# EAGLE schematic SFT_MotorBridge (EAGLE 7.2.0)
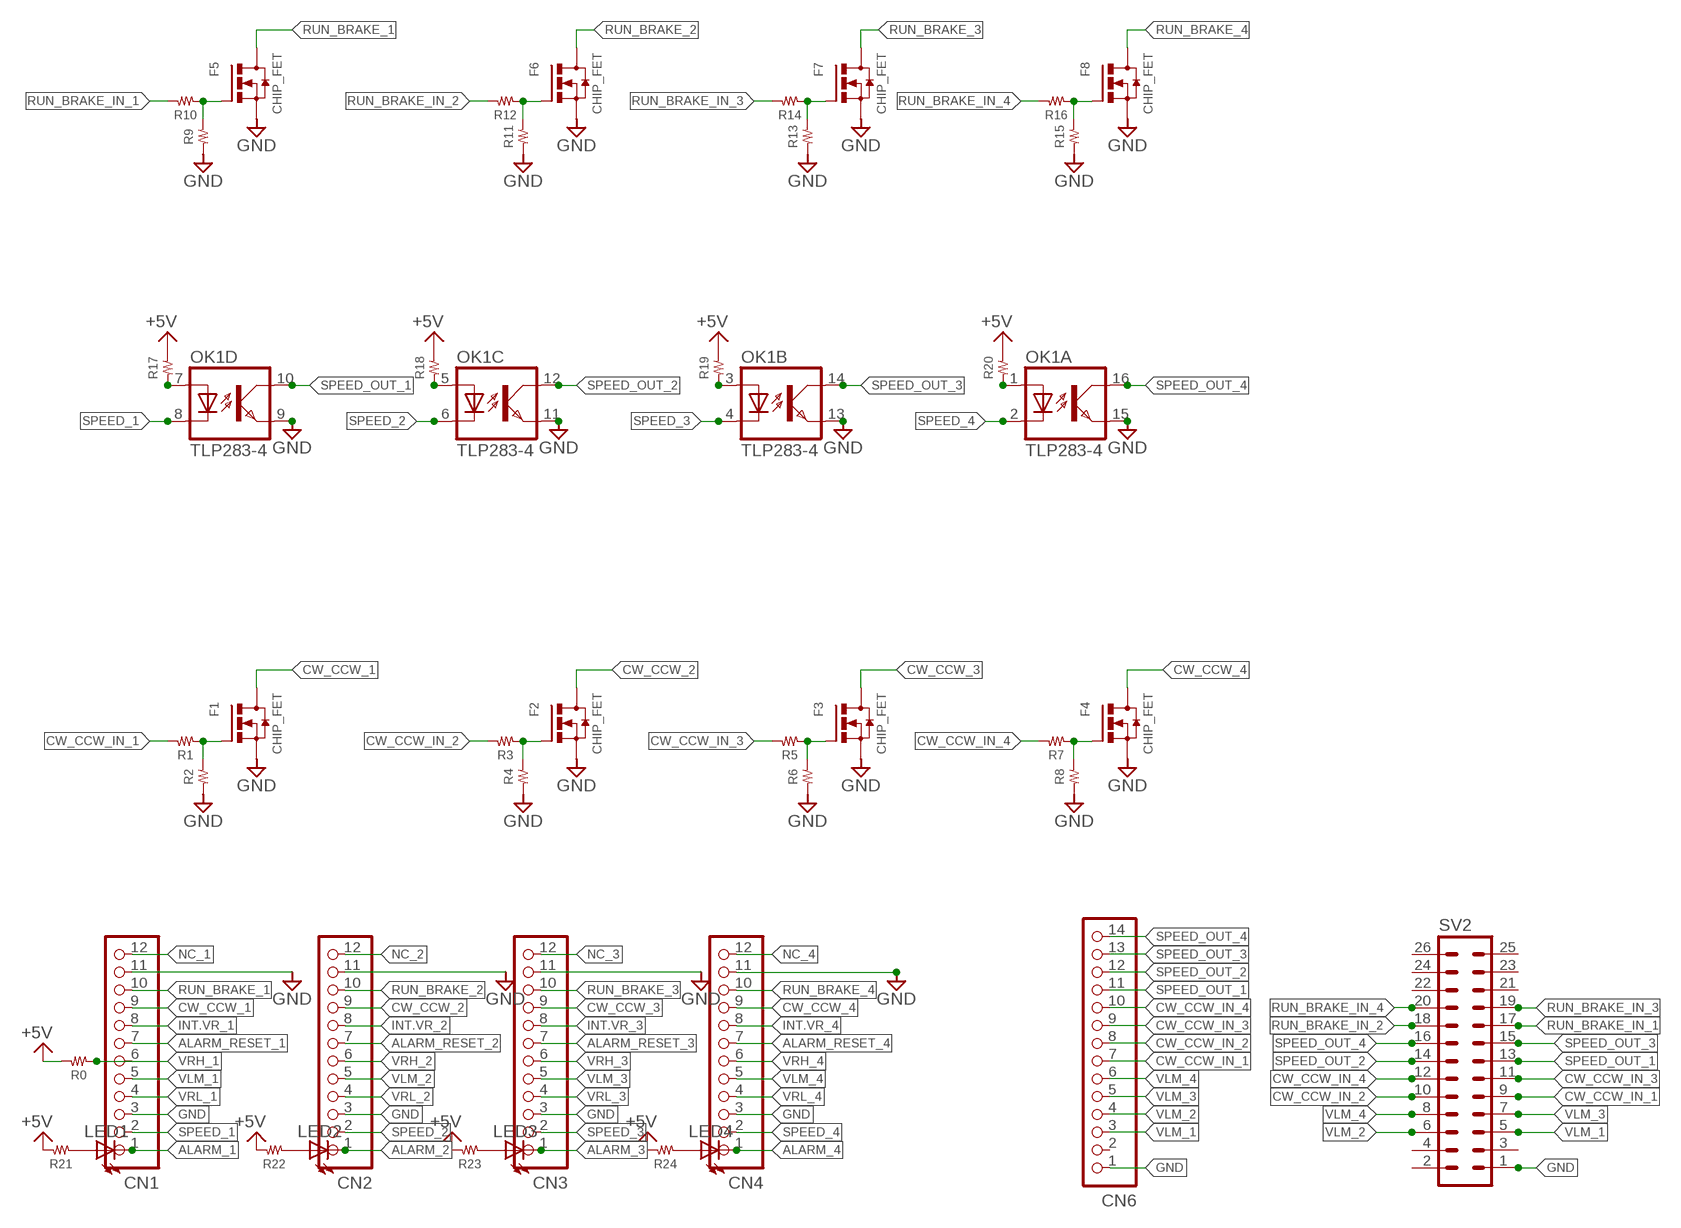
[diagram p0: schematic, sheet 1]

## Parts
CN1  B12B-XASK-1  [B12B-XASK-1]
CN2  B12B-XASK-1  [B12B-XASK-1]
CN3  B12B-XASK-1  [B12B-XASK-1]
CN4  B12B-XASK-1  [B12B-XASK-1]
CN6  B14B-XASK-1  [B14B-XASK-1]
F1  CHIP_FET  [SOT23]
F2  CHIP_FET  [SOT23]
F3  CHIP_FET  [SOT23]
F4  CHIP_FET  [SOT23]
F5  CHIP_FET  [SOT23]
F6  CHIP_FET  [SOT23]
F7  CHIP_FET  [SOT23]
F8  CHIP_FET  [SOT23]
LED1  LED5MM  [LED5MM]
LED2  LED5MM  [LED5MM]
LED3  LED5MM  [LED5MM]
LED4  LED5MM  [LED5MM]
OK1  TLP283-4  [MINI-FLAT-16]
R0  RESISTOR__SMD  [1608]
R1  RESISTOR__SMD  [1608]
R2  RESISTOR__SMD  [1608]
R3  RESISTOR__SMD  [1608]
R4  RESISTOR__SMD  [1608]
R5  RESISTOR__SMD  [1608]
R6  RESISTOR__SMD  [1608]
R7  RESISTOR__SMD  [1608]
R8  RESISTOR__SMD  [1608]
R9  RESISTOR__SMD  [1608]
R10  RESISTOR__SMD  [1608]
R11  RESISTOR__SMD  [1608]
R12  RESISTOR__SMD  [1608]
R13  RESISTOR__SMD  [1608]
R14  RESISTOR__SMD  [1608]
R15  RESISTOR__SMD  [1608]
R16  RESISTOR__SMD  [1608]
R17  RESISTOR__SMD  [1608]
R18  RESISTOR__SMD  [1608]
R19  RESISTOR__SMD  [1608]
R20  RESISTOR__SMD  [1608]
R21  RESISTOR__SMD  [1608]
R22  RESISTOR__SMD  [1608]
R23  RESISTOR__SMD  [1608]
R24  RESISTOR__SMD  [1608]
SV2  ML26  [ML26]

## Nets
+5V: R0.2 R17.2 R18.2 R19.2 R20.2 R21.2 R22.2 R23.2 R24.2
ALARM_1: CN1.1 LED1.K(C)
ALARM_2: CN2.1 LED2.K(C)
ALARM_3: CN3.1 LED3.K(C)
ALARM_4: CN4.1 LED4.K(C)
ALARM_RESET_1: CN1.7
ALARM_RESET_2: CN2.7
ALARM_RESET_3: CN3.7
ALARM_RESET_4: CN4.7
CW_CCW_1: CN1.9 F1.3(D)
CW_CCW_2: CN2.9 F2.3(D)
CW_CCW_3: CN3.9 F3.3(D)
CW_CCW_4: CN4.9 F4.3(D)
CW_CCW_IN_1: CN6.7 R1.2 SV2.9
CW_CCW_IN_2: CN6.8 R3.2 SV2.10
CW_CCW_IN_3: CN6.9 R5.2 SV2.11
CW_CCW_IN_4: CN6.10 R7.2 SV2.12
GND: CN1.3 CN1.11 CN2.3 CN2.11 CN3.3 CN3.11 CN4.3 CN4.11 F1.2(S) F2.2(S) F3.2(S) F4.2(S) F5.2(S) F6.2(S) F7.2(S) F8.2(S) OK1.9(D:EMIT) OK1.11(C:EMIT) OK1.13(B:EMIT) OK1.15(A:EMIT) R2.1 R4.1 R6.1 R8.1 R9.1 R11.1 R13.1 R15.1 SV2.1
INT.VR_1: CN1.8
INT.VR_2: CN2.8
INT.VR_3: CN3.8
INT.VR_4: CN4.8
N$1: F1.1(G) R1.1 R2.2
N$2: F2.1(G) R3.1 R4.2
N$3: F3.1(G) R5.1 R6.2
N$4: F4.1(G) R7.1 R8.2
N$5: OK1.3(B:A) R19.1
N$6: OK1.5(C:A) R18.1
N$7: OK1.7(D:A) R17.1
N$8: OK1.1(A:A) R20.1
N$9: F5.1(G) R9.2 R10.1
N$10: F6.1(G) R11.2 R12.1
N$11: F7.1(G) R13.2 R14.1
N$12: F8.1(G) R15.2 R16.1
N$13: LED1.A R21.1
N$14: LED2.A R22.1
N$15: LED3.A R23.1
N$16: LED4.A R24.1
NC_1: CN1.12
NC_2: CN2.12
NC_3: CN3.12
NC_4: CN4.12
RUN_BRAKE_1: CN1.10 F5.3(D)
RUN_BRAKE_2: CN2.10 F6.3(D)
RUN_BRAKE_3: CN3.10 F7.3(D)
RUN_BRAKE_4: CN4.10 F8.3(D)
RUN_BRAKE_IN_1: R10.2 SV2.17
RUN_BRAKE_IN_2: R12.2 SV2.18
RUN_BRAKE_IN_3: R14.2 SV2.19
RUN_BRAKE_IN_4: R16.2 SV2.20
SPEED_1: CN1.2 OK1.8(D:C)
SPEED_2: CN2.2 OK1.6(C:C)
SPEED_3: CN3.2 OK1.4(B:C)
SPEED_4: CN4.2 OK1.2(A:C)
SPEED_OUT_1: CN6.11 OK1.10(D:COL) SV2.13
SPEED_OUT_2: CN6.12 OK1.12(C:COL) SV2.14
SPEED_OUT_3: CN6.13 OK1.14(B:COL) SV2.15
SPEED_OUT_4: CN6.14 OK1.16(A:COL) SV2.16
VLM_1: CN1.5 CN6.3 SV2.5
VLM_2: CN2.5 CN6.4 SV2.6
VLM_3: CN3.5 CN6.5 SV2.7
VLM_4: CN4.5 CN6.6 SV2.8
VRH_1: CN1.6 R0.1
VRH_2: CN2.6
VRH_3: CN3.6
VRH_4: CN4.6
VRL_1: CN1.4
VRL_2: CN2.4
VRL_3: CN3.4
VRL_4: CN4.4
Unconnected: CN6.1 CN6.2 SV2.2 SV2.3 SV2.4 SV2.21 SV2.22 SV2.23 SV2.24 SV2.25 SV2.26

## Library data of the parts
CN1-CN4 = jst-xa:B12B-XASK-1: Wire-to-Board 2.5mm pitch top mount connector Source: http://www.jst-mfg.com/product/pdf/jpn/XA1.pdf http://www.jst-mfg.com/product/detail.php?series=272
CN6 = jst-xa:B14B-XASK-1: Wire-to-Board 2.5mm pitch top mount connector Source: http://www.jst-mfg.com/product/pdf/jpn/XA1.pdf http://www.jst-mfg.com/product/detail.php?series=272
F1-F8 = 06_FET:CHIP_FET
LED1-LED4 = led:LED: LED OSRAM: - CHIPLED LG R971, LG N971, LY N971, LG Q971, LY Q971, LO R971, LY R971 LH N974, LH R974 LS Q976, LO Q976, LY Q976 LO Q996 - Hyper CHIPLED LW Q18S LB Q993, LB Q99A, LB R99A - SideLED LS A670, LO A670, LY A670, LG A670, LP A670 LB A673, LV A673, LT A673, LW A673 LH A674 LY A675 LS A676, LA A676, LO A676, LY A676, LW A676 LS A679, LY A679, LG A679 - Hyper Micro SIDELED® LS Y876, LA Y876, LO Y876, LY Y876 LT Y87S - SmartLED LW L88C, LW L88S LB L89C, LB L89S, LG L890 LS L89K, LO L89K, LY L89K LS L896, LA L896, LO L896, LY L896 - TOPLED LS T670, LO T670, LY T670, LG T670, LP T670 LSG T670, LSP T670, LSY T670, LOP T670, LYG T670 LG T671, LOG T671, LSG T671 LB T673, LV T673, LT T673, LW T673 LH T674 LS T676, LA T676, LO T676, LY T676, LB T676, LH T676, LSB T676, LW T676 LB T67C, LV T67C, LT T67C, LS T67K, LO T67K, LY T67K, LW E67C LS E67B, LA E67B, LO E67B, LY E67B, LB E67C, LV E67C, LT E67C LW T67C LS T679, LY T679, LG T679 LS T770, LO T770, LY T770, LG T770, LP T770 LB T773, LV T773, LT T773, LW T773 LH T774 LS E675, LA E675, LY E675, LS T675 LS T776, LA T776, LO T776, LY T776, LB T776 LHGB T686 LT T68C, LB T68C - Hyper Mini TOPLED® LB M676 - Mini TOPLED Santana® LG M470 LS M47K, LO M47K, LY M47K Source: http://www.osram.convergy.de LUXEON: - LUMILED® LXK2-PW12-R00, LXK2-PW12-S00, LXK2-PW14-U00, LXK2-PW14-V00 LXK2-PM12-R00, LXK2-PM12-S00, LXK2-PM14-U00 LXK2-PE12-Q00, LXK2-PE12-R00, LXK2-PE12-S00, LXK2-PE14-T00, LXK2-PE14-U00 LXK2-PB12-K00, LXK2-PB12-L00, LXK2-PB12-M00, LXK2-PB14-N00, LXK2-PB14-P00, LXK2-PB14-Q00 LXK2-PR12-L00, LXK2-PR12-M00, LXK2-PR14-Q00, LXK2-PR14-R00 LXK2-PD12-Q00, LXK2-PD12-R00, LXK2-PD12-S00 LXK2-PH12-R00, LXK2-PH12-S00 LXK2-PL12-P00, LXK2-PL12-Q00, LXK2-PL12-R00 Source: www.luxeon.com KINGBRIGHT: KA-3528ASYC Source: www.kingbright.com
OK1 = optocoupler:TLP283-4: TOSHIBA PHOTOCOUPLER GaAs IRED & PHOTO-TRANSISTOR Source: http://www.semicon.toshiba.co.jp/td/en/Opto/Photocoupler/en_20050928_TLP283_datasheet.pdf; OC_FARNELL: unknown; OC_NEWARK: unknown
R0 R1-R24 = 01_R:RESISTOR__SMD
SV2 = con-ml:ML26: HARTING; OC_FARNELL: unknown; OC_NEWARK: unknown